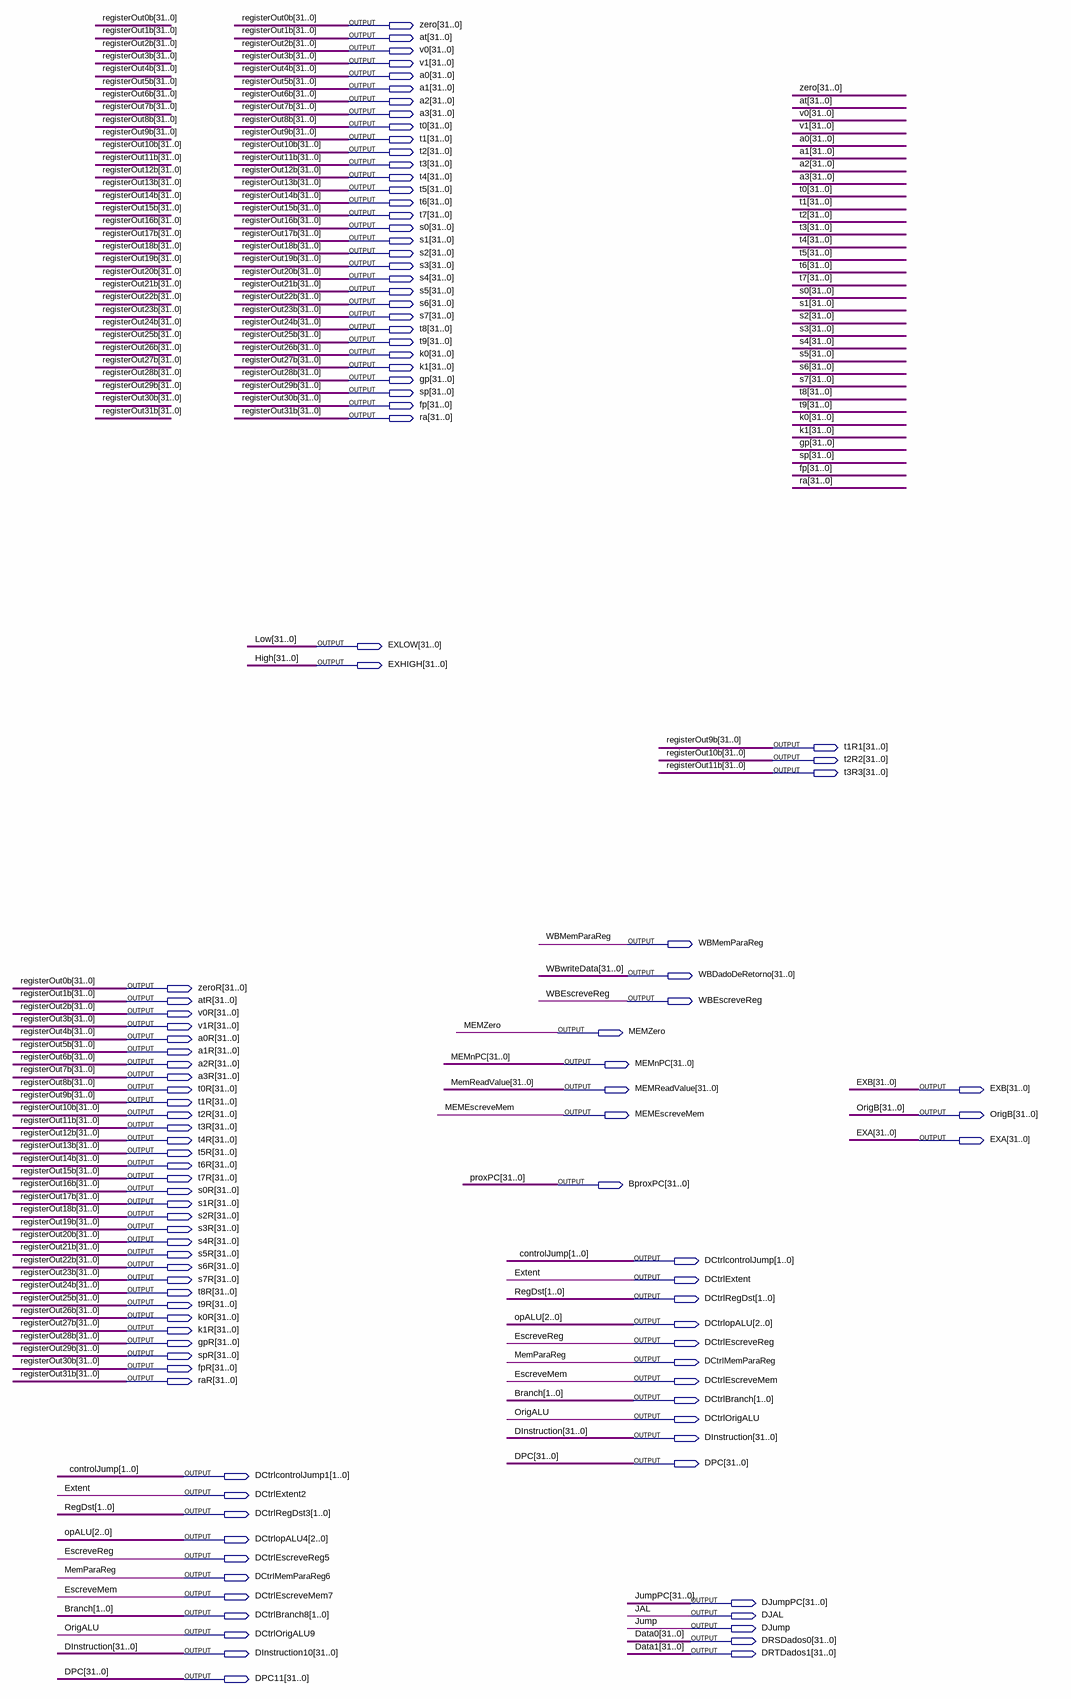
[diagram p0: schematic sheet]
// Quartus schematic tempFios.bdf as structural Verilog: 0 symbols, 107 pins
module tempFios (
  output [31:0] zero,
  output [31:0] at,
  output [31:0] v0,
  output [31:0] v1,
  output [31:0] a0,
  output [31:0] a1,
  output [31:0] a2,
  output [31:0] a3,
  output [31:0] t0,
  output [31:0] t1,
  output [31:0] t2,
  output [31:0] t3,
  output [31:0] t4,
  output [31:0] t5,
  output [31:0] t6,
  output [31:0] t7,
  output [31:0] s0,
  output [31:0] s1,
  output [31:0] s2,
  output [31:0] s3,
  output [31:0] s4,
  output [31:0] s5,
  output [31:0] s6,
  output [31:0] s7,
  output [31:0] t8,
  output [31:0] t9,
  output [31:0] k0,
  output [31:0] k1,
  output [31:0] gp,
  output [31:0] sp,
  output [31:0] fp,
  output [31:0] ra,
  output [31:0] EXLOW,
  output [31:0] EXHIGH,
  output [31:0] t1R1,
  output [31:0] t2R2,
  output [31:0] t3R3,
  output WBMemParaReg,
  output [31:0] WBDadoDeRetorno,
  output [31:0] zeroR,
  output [31:0] atR,
  output WBEscreveReg,
  output [31:0] v0R,
  output [31:0] v1R,
  output MEMZero,
  output [31:0] a0R,
  output [31:0] a1R,
  output [31:0] a2R,
  output [31:0] MEMnPC,
  output [31:0] a3R,
  output [31:0] t0R,
  output [31:0] MEMReadValue,
  output [31:0] EXB,
  output [31:0] t1R,
  output [31:0] t2R,
  output MEMEscreveMem,
  output [31:0] OrigB,
  output [31:0] t3R,
  output [31:0] t4R,
  output [31:0] EXA,
  output [31:0] t5R,
  output [31:0] t6R,
  output [31:0] t7R,
  output [31:0] BproxPC,
  output [31:0] s0R,
  output [31:0] s1R,
  output [31:0] s2R,
  output [31:0] s3R,
  output [31:0] s4R,
  output [31:0] s5R,
  output [1:0] DCtrlcontrolJump,
  output [31:0] s6R,
  output [31:0] s7R,
  output DCtrlExtent,
  output [31:0] t8R,
  output [1:0] DCtrlRegDst,
  output [31:0] t9R,
  output [31:0] k0R,
  output [2:0] DCtrlopALU,
  output [31:0] k1R,
  output [31:0] gpR,
  output DCtrlEscreveReg,
  output [31:0] spR,
  output DCtrlMemParaReg,
  output [31:0] fpR,
  output [31:0] raR,
  output DCtrlEscreveMem,
  output [1:0] DCtrlBranch,
  output DCtrlOrigALU,
  output [31:0] DInstruction,
  output [31:0] DPC,
  output [1:0] DCtrlcontrolJump1,
  output DCtrlExtent2,
  output [1:0] DCtrlRegDst3,
  output [2:0] DCtrlopALU4,
  output DCtrlEscreveReg5,
  output DCtrlMemParaReg6,
  output DCtrlEscreveMem7,
  output [31:0] DJumpPC,
  output [1:0] DCtrlBranch8,
  output DJAL,
  output DJump,
  output DCtrlOrigALU9,
  output [31:0] DRSDados0,
  output [31:0] DInstruction10,
  output [31:0] DRTDados1,
  output [31:0] DPC11
);


  assign a0R = a0;
  assign a1R = a1;
  assign a2R = a2;
  assign a3R = a3;
  assign atR = at;
  assign DCtrlBranch8 = DCtrlBranch;
  assign DCtrlcontrolJump1 = DCtrlcontrolJump;
  assign DCtrlEscreveMem7 = DCtrlEscreveMem;
  assign DCtrlEscreveReg5 = DCtrlEscreveReg;
  assign DCtrlExtent2 = DCtrlExtent;
  assign DCtrlMemParaReg6 = DCtrlMemParaReg;
  assign DCtrlopALU4 = DCtrlopALU;
  assign DCtrlOrigALU9 = DCtrlOrigALU;
  assign DCtrlRegDst3 = DCtrlRegDst;
  assign DInstruction10 = DInstruction;
  assign DPC11 = DPC;
  assign fpR = fp;
  assign gpR = gp;
  assign k0R = k0;
  assign k1R = k1;
  assign raR = ra;
  assign s0R = s0;
  assign s1R = s1;
  assign s2R = s2;
  assign s3R = s3;
  assign s4R = s4;
  assign s5R = s5;
  assign s6R = s6;
  assign s7R = s7;
  assign spR = sp;
  assign t0R = t0;
  assign t1R = t1;
  assign t1R1 = t1;
  assign t2R = t2;
  assign t2R2 = t2;
  assign t3R = t3;
  assign t3R3 = t3;
  assign t4R = t4;
  assign t5R = t5;
  assign t6R = t6;
  assign t7R = t7;
  assign t8R = t8;
  assign t9R = t9;
  assign v0R = v0;
  assign v1R = v1;
  assign zeroR = zero;

  // Other names for the same wires on the sheet: Branch[1:0] = DCtrlBranch; controlJump[1:0] = DCtrlcontrolJump;
  //   Data0[31:0] = DRSDados0; Data1[31:0] = DRTDados1; EscreveMem = DCtrlEscreveMem; EscreveReg = DCtrlEscreveReg;
  //   Extent = DCtrlExtent; High[31:0] = EXHIGH; JAL = DJAL; Jump = DJump; JumpPC[31:0] = DJumpPC; Low[31:0] = EXLOW;
  //   MemParaReg = DCtrlMemParaReg; opALU[2:0] = DCtrlopALU; OrigALU = DCtrlOrigALU; proxPC[31:0] = BproxPC;
  //   RegDst[1:0] = DCtrlRegDst; registerOut0b[31:0] = zero; registerOut1b[31:0] = at; registerOut2b[31:0] = v0;
  //   registerOut3b[31:0] = v1; registerOut4b[31:0] = a0; registerOut5b[31:0] = a1; registerOut6b[31:0] = a2;
  //   registerOut7b[31:0] = a3; registerOut8b[31:0] = t0; registerOut9b[31:0] = t1; registerOut10b[31:0] = t2;
  //   registerOut11b[31:0] = t3; registerOut12b[31:0] = t4; registerOut13b[31:0] = t5; registerOut14b[31:0] = t6;
  //   registerOut15b[31:0] = t7; registerOut16b[31:0] = s0; registerOut17b[31:0] = s1; registerOut18b[31:0] = s2;
  //   registerOut19b[31:0] = s3; registerOut20b[31:0] = s4; registerOut21b[31:0] = s5; registerOut22b[31:0] = s6;
  //   registerOut23b[31:0] = s7; registerOut24b[31:0] = t8; registerOut25b[31:0] = t9; registerOut26b[31:0] = k0;
  //   registerOut27b[31:0] = k1; registerOut28b[31:0] = gp; registerOut29b[31:0] = sp; registerOut30b[31:0] = fp;
  //   registerOut31b[31:0] = ra; WBwriteData[31:0] = WBDadoDeRetorno
endmodule
